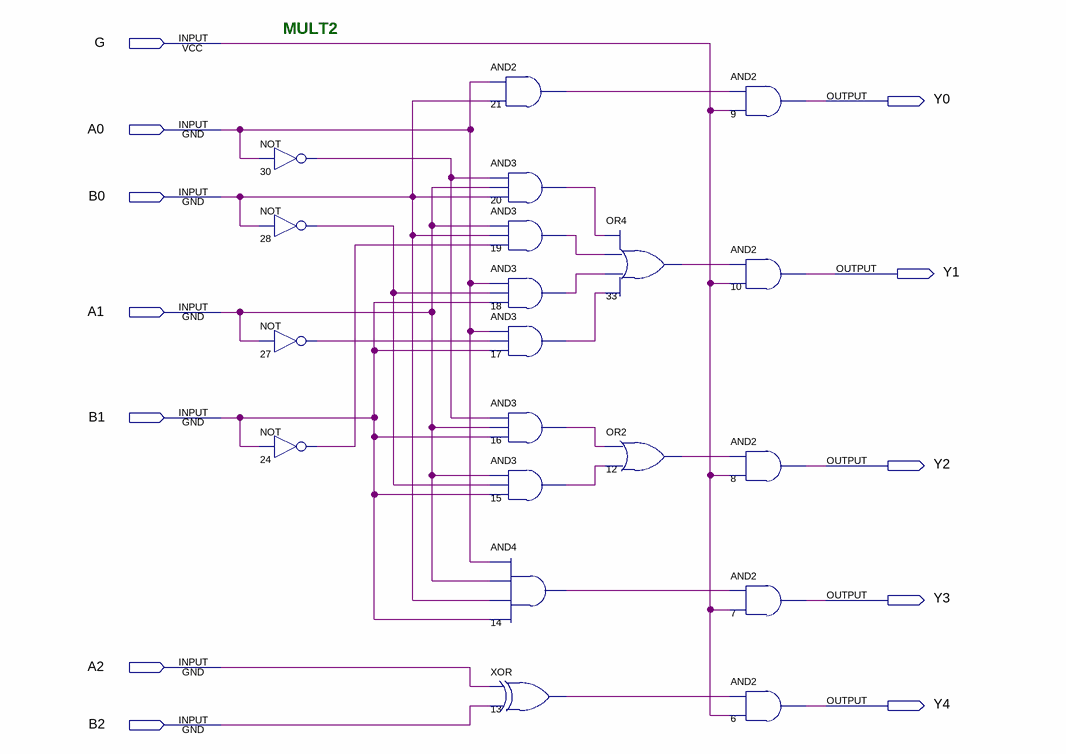
[diagram p0: schematic sheet]
// Quartus schematic mult2.bdf as structural Verilog: 20 symbols, 12 pins
module mult2 (
  input  G,
  input  A0,
  input  B0,
  input  A1,
  input  B1,
  input  A2,
  input  B2,
  output Y0,
  output Y1,
  output Y2,
  output Y3,
  output Y4
);

  wire n12_out, n13_out, n14_out, n15_out, n16_out, n17_out, n18_out, n19_out, n20_out, n21_out, n24_out,
       n27_out, n28_out, n30_out, n33_out;

  not u_30 (n30_out, A0);
  not u_28 (n28_out, B0);
  not u_27 (n27_out, A1);
  not u_24 (n24_out, B1);
  and u_21 (n21_out, A0, B0);
  and u_20 (n20_out, n30_out, A1, B0);
  and u_19 (n19_out, A1, B0, n24_out);
  and u_18 (n18_out, A0, n28_out, B1);
  and u_17 (n17_out, A0, n27_out, B1);
  and u_16 (n16_out, n30_out, A1, B1);
  and u_15 (n15_out, A1, n28_out, B1);
  and u_14 (n14_out, A0, A1, B0, B1);
  xor u_13 (n13_out, A2, B2);
  or u_33 (n33_out, n20_out, n19_out, n18_out, n17_out);
  or u_12 (n12_out, n16_out, n15_out);
  and u_9 (Y0, n21_out, G);
  and u_10 (Y1, n33_out, G);
  and u_8 (Y2, n12_out, G);
  and u_7 (Y3, n14_out, G);
  and u_6 (Y4, n13_out, G);

  // Notes on the sheet:
  //   MULT2
endmodule
